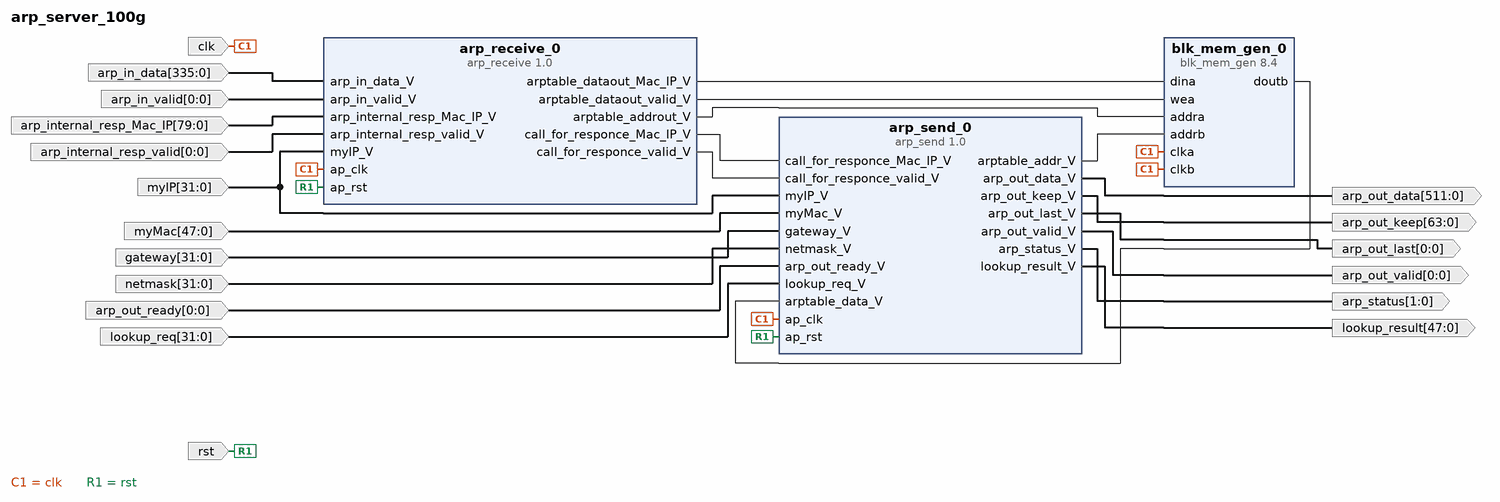
[diagram p0: block diagram of the top level]
# Vivado block design arp_server_100g, xcu200-fsgd2104-2-e, Vivado 2019.1
create_bd_design arp_server_100g

create_bd_port -dir I -type clk clk
create_bd_port -dir I -type rst rst
set_property -dict {CONFIG.POLARITY ACTIVE_HIGH} [get_bd_ports rst]
create_bd_port -dir I -from 47 -to 0 -type data myMac
create_bd_port -dir I -from 31 -to 0 -type data myIP
create_bd_port -dir I -from 31 -to 0 -type data gateway
create_bd_port -dir I -from 31 -to 0 -type data netmask
create_bd_port -dir I -from 335 -to 0 -type data arp_in_data
create_bd_port -dir I -from 0 -to 0 -type data arp_in_valid
create_bd_port -dir O -from 511 -to 0 -type data arp_out_data
create_bd_port -dir O -from 63 -to 0 -type data arp_out_keep
create_bd_port -dir O -from 0 -to 0 -type data arp_out_last
create_bd_port -dir O -from 0 -to 0 -type data arp_out_valid
create_bd_port -dir I -from 0 -to 0 -type data arp_out_ready
create_bd_port -dir O -from 47 -to 0 -type data lookup_result
create_bd_port -dir I -from 31 -to 0 -type data lookup_req
create_bd_port -dir O -from 1 -to 0 -type data arp_status
create_bd_port -dir I -from 79 -to 0 -type data arp_internal_resp_Mac_IP
create_bd_port -dir I -from 0 -to 0 -type data arp_internal_resp_valid

create_bd_cell -type ip -vlnv xilinx.com:hls:arp_receive:1.0 arp_receive_0
create_bd_cell -type ip -vlnv xilinx.com:hls:arp_send:1.0 arp_send_0
create_bd_cell -type ip -vlnv xilinx.com:ip:blk_mem_gen:8.4 blk_mem_gen_0
set_property -dict [list \
  CONFIG.Assume_Synchronous_Clk true \
  CONFIG.Enable_32bit_Address false \
  CONFIG.Enable_A Always_Enabled \
  CONFIG.Enable_B Always_Enabled \
  CONFIG.Memory_Type Simple_Dual_Port_RAM \
  CONFIG.Operating_Mode_A NO_CHANGE \
  CONFIG.Port_B_Clock 100 \
  CONFIG.Port_B_Enable_Rate 100 \
  CONFIG.Read_Width_B 80 \
  CONFIG.Register_PortB_Output_of_Memory_Primitives true \
  CONFIG.Use_Byte_Write_Enable false \
  CONFIG.Write_Depth_A 256 \
  CONFIG.Write_Width_A 80 \
  CONFIG.Write_Width_B 80 \
  CONFIG.use_bram_block Stand_Alone \
] [get_bd_cells blk_mem_gen_0]

# ---- connections ----

connect_bd_net -net ap_clk_0_1 [get_bd_ports clk] \
  [get_bd_pins arp_receive_0/ap_clk] [get_bd_pins blk_mem_gen_0/clkb] [get_bd_pins blk_mem_gen_0/clka] \
  [get_bd_pins arp_send_0/ap_clk]
connect_bd_net -net ap_rst_0_1 [get_bd_ports rst] [get_bd_pins arp_receive_0/ap_rst] [get_bd_pins arp_send_0/ap_rst]
connect_bd_net -net myMac_V_0_1 [get_bd_ports myMac] [get_bd_pins arp_send_0/myMac_V]
connect_bd_net -net myIP_V_0_1 [get_bd_ports myIP] [get_bd_pins arp_send_0/myIP_V] [get_bd_pins arp_receive_0/myIP_V]
connect_bd_net -net gateway_V_0_1 [get_bd_ports gateway] [get_bd_pins arp_send_0/gateway_V]
connect_bd_net -net netmask_V_0_1 [get_bd_ports netmask] [get_bd_pins arp_send_0/netmask_V]
connect_bd_net -net arp_in_data_V_0_1 [get_bd_ports arp_in_data] [get_bd_pins arp_receive_0/arp_in_data_V]
connect_bd_net -net arp_in_valid_V_0_1 [get_bd_ports arp_in_valid] [get_bd_pins arp_receive_0/arp_in_valid_V]
connect_bd_net [get_bd_pins arp_send_0/arp_out_data_V] [get_bd_ports arp_out_data]
connect_bd_net [get_bd_pins arp_send_0/arp_out_keep_V] [get_bd_ports arp_out_keep]
connect_bd_net [get_bd_pins arp_send_0/arp_out_last_V] [get_bd_ports arp_out_last]
connect_bd_net [get_bd_pins arp_send_0/arp_out_valid_V] [get_bd_ports arp_out_valid]
connect_bd_net -net arp_out_ready_V_0_1 [get_bd_ports arp_out_ready] [get_bd_pins arp_send_0/arp_out_ready_V]
connect_bd_net [get_bd_pins arp_send_0/lookup_result_V] [get_bd_ports lookup_result]
connect_bd_net -net lookup_req_V_0_1 [get_bd_ports lookup_req] [get_bd_pins arp_send_0/lookup_req_V]
connect_bd_net [get_bd_pins arp_send_0/arp_status_V] [get_bd_ports arp_status]
connect_bd_net -net arp_internal_resp_Mac_IP_V_0_1 [get_bd_ports arp_internal_resp_Mac_IP] [get_bd_pins arp_receive_0/arp_internal_resp_Mac_IP_V]
connect_bd_net -net arp_internal_resp_valid_V_0_1 [get_bd_ports arp_internal_resp_valid] [get_bd_pins arp_receive_0/arp_internal_resp_valid_V]
connect_bd_net [get_bd_pins arp_send_0/arptable_addr_V] [get_bd_pins blk_mem_gen_0/addrb]
connect_bd_net [get_bd_pins blk_mem_gen_0/doutb] [get_bd_pins arp_send_0/arptable_data_V]
connect_bd_net [get_bd_pins arp_receive_0/arptable_dataout_Mac_IP_V] [get_bd_pins blk_mem_gen_0/dina]
connect_bd_net [get_bd_pins arp_receive_0/arptable_dataout_valid_V] [get_bd_pins blk_mem_gen_0/wea]
connect_bd_net [get_bd_pins arp_receive_0/arptable_addrout_V] [get_bd_pins blk_mem_gen_0/addra]
connect_bd_net [get_bd_pins arp_receive_0/call_for_responce_Mac_IP_V] [get_bd_pins arp_send_0/call_for_responce_Mac_IP_V]
connect_bd_net [get_bd_pins arp_receive_0/call_for_responce_valid_V] [get_bd_pins arp_send_0/call_for_responce_valid_V]

validate_bd_design
save_bd_design
